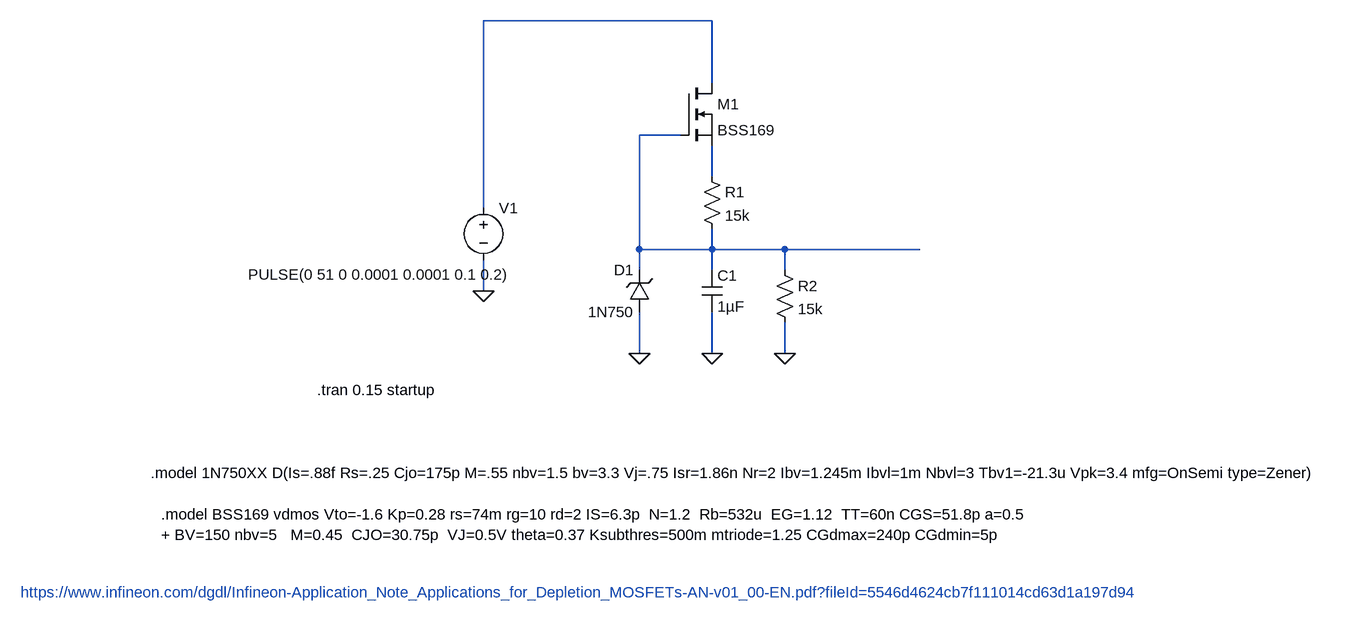
[diagram p0: schematic CapDischarge_DepletionNMos_Zener.asc]
CapDischarge_DepletionNMos_Zener.asc, the LTspice schematic file:
Version 4
SHEET 1 1496 680
WIRE 272 -240 -80 -240
WIRE 272 -144 272 -240
WIRE 224 -64 160 -64
WIRE 272 0 272 -48
WIRE -80 48 -80 -240
WIRE 160 112 160 -64
WIRE 272 112 272 80
WIRE 272 112 160 112
WIRE 384 112 272 112
WIRE 592 112 384 112
WIRE 160 144 160 112
WIRE 272 144 272 112
WIRE 384 144 384 112
WIRE -80 176 -80 128
WIRE 160 272 160 208
WIRE 272 272 272 208
WIRE 384 272 384 224
FLAG -80 176 0
FLAG 160 272 0
FLAG 272 272 0
FLAG 384 272 0
SYMBOL voltage -80 32 R0
WINDOW 3 -362 119 Left 2
WINDOW 123 0 0 Left 0
WINDOW 39 0 0 Left 0
SYMATTR Value PULSE(0 51 0 0.0001 0.0001 0.1 0.2)
SYMATTR InstName V1
SYMBOL nmos 224 -144 R0
SYMATTR InstName M1
SYMATTR Value BSS169
SYMBOL res 256 -16 R0
SYMATTR InstName R1
SYMATTR Value 15k
SYMBOL zener 176 208 R180
WINDOW 0 24 64 Left 2
WINDOW 3 24 0 Left 2
SYMATTR InstName D1
SYMATTR Value 1N750
SYMBOL cap 256 144 R0
SYMATTR InstName C1
SYMATTR Value 1µF
SYMBOL res 368 128 R0
SYMATTR InstName R2
SYMATTR Value 15k
TEXT -336 328 Left 2 !.tran 0.15 startup
TEXT -592 456 Left 2 !.model 1N750XX D(Is=.88f Rs=.25 Cjo=175p M=.55 nbv=1.5 bv=3.3 Vj=.75 Isr=1.86n Nr=2 Ibv=1.245m Ibvl=1m Nbvl=3 Tbv1=-21.3u Vpk=3.4 mfg=OnSemi type=Zener)
TEXT -576 520 Left 2 !.model BSS169 vdmos Vto=-1.6 Kp=0.28 rs=74m rg=10 rd=2 IS=6.3p  N=1.2  Rb=532u  EG=1.12  TT=60n CGS=51.8p a=0.5\n+ BV=150 nbv=5   M=0.45  CJO=30.75p  VJ=0.5V theta=0.37 Ksubthres=500m mtriode=1.25 CGdmax=240p CGdmin=5p
TEXT -792 640 Left 2 ;https://www.infineon.com/dgdl/Infineon-Application_Note_Applications_for_Depletion_MOSFETs-AN-v01_00-EN.pdf?fileId=5546d4624cb7f111014cd63d1a197d94

The netlist it stands for:
* CapDischarge_DepletionNMos_Zener.asc
V1 N001 0 PULSE(0 51 0 0.0001 0.0001 0.1 0.2)
M1 N001 N002 N003 N003 BSS169
R1 N003 N002 15k
D1 0 N002 1N750
C1 N002 0 1µF
R2 N002 0 15k
.model D D
.lib standard.dio
.model NMOS NMOS
.model PMOS PMOS
.lib standard.mos
.tran 0.15 startup
.model 1N750XX D(Is=.88f Rs=.25 Cjo=175p M=.55 nbv=1.5 bv=3.3 Vj=.75 Isr=1.86n Nr=2 Ibv=1.245m Ibvl=1m Nbvl=3 Tbv1=-21.3u Vpk=3.4 mfg=OnSemi type=Zener)
.model BSS169 vdmos Vto=-1.6 Kp=0.28 rs=74m rg=10 rd=2 IS=6.3p  N=1.2  Rb=532u  EG=1.12  TT=60n CGS=51.8p a=0.5
+ BV=150 nbv=5   M=0.45  CJO=30.75p  VJ=0.5V theta=0.37 Ksubthres=500m mtriode=1.25 CGdmax=240p CGdmin=5p
* https://www.infineon.com/dgdl/Infineon-Application_Note_Applications_for_Depletion_MOSFETs-AN-v01_00-EN.pdf?fileId=5546d4624cb7f111014cd63d1a197d94
.backanno
.end